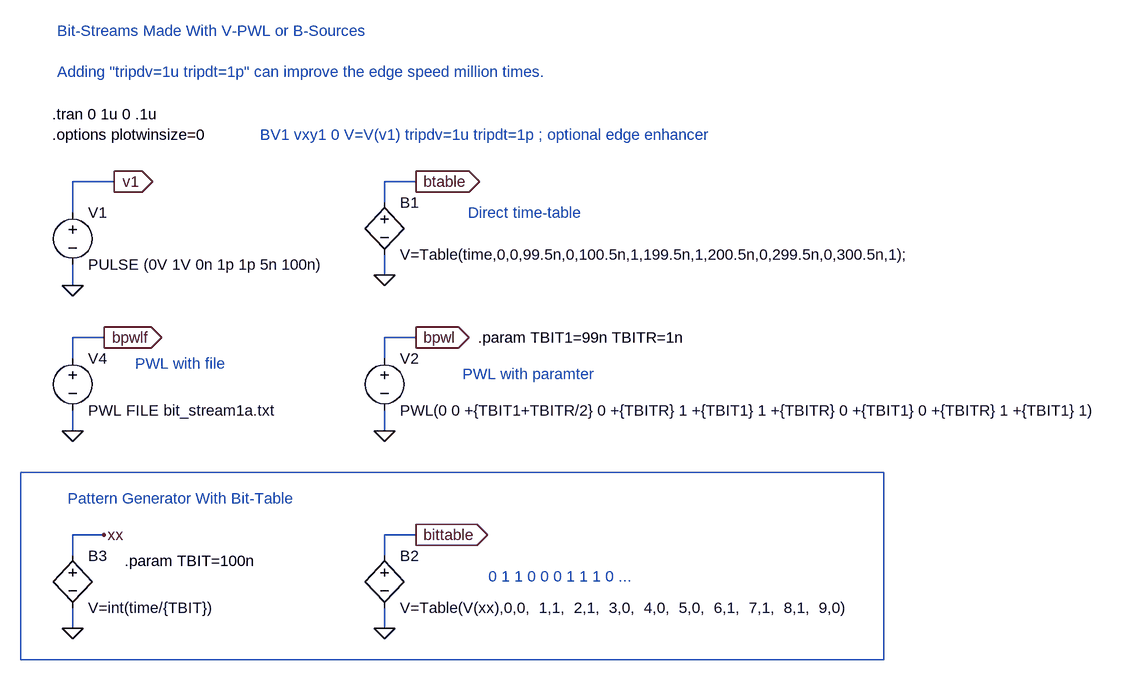
[diagram p0: schematic bit_stream.asc]
bit_stream.asc, the LTspice schematic file:
Version 4
SHEET 1 1644 708
WIRE -32 -32 -96 -32
WIRE 432 -32 384 -32
WIRE 384 0 384 -32
WIRE -96 16 -96 -32
WIRE 384 112 384 80
WIRE -96 128 -96 96
WIRE -48 208 -96 208
WIRE 432 208 384 208
WIRE -96 240 -96 208
WIRE 384 240 384 208
WIRE -96 352 -96 320
WIRE 384 352 384 320
WIRE -48 512 -96 512
WIRE 432 512 384 512
WIRE -96 544 -96 512
WIRE 384 544 384 512
WIRE -96 656 -96 624
WIRE 384 656 384 624
FLAG -96 128 0
FLAG -32 -32 v1
IOPIN -32 -32 Out
FLAG 384 352 0
FLAG -96 352 0
FLAG 384 112 0
FLAG 432 -32 btable
IOPIN 432 -32 Out
FLAG 432 208 bpwl
IOPIN 432 208 Out
FLAG -48 208 bpwlf
IOPIN -48 208 Out
FLAG 384 656 0
FLAG 432 512 bittable
IOPIN 432 512 Out
FLAG -96 656 0
FLAG -48 512 xx
SYMBOL voltage -96 0 R0
WINDOW 123 0 0 Left 0
WINDOW 39 0 0 Left 0
SYMATTR InstName V1
SYMATTR Value PULSE (0V 1V 0n 1p 1p 5n 100n)
SYMBOL voltage 384 224 R0
WINDOW 123 0 0 Left 0
WINDOW 39 0 0 Left 0
SYMATTR InstName V2
SYMATTR Value PWL(0 0 +{TBIT1+TBITR/2} 0 +{TBITR} 1 +{TBIT1} 1 +{TBITR} 0 +{TBIT1} 0 +{TBITR} 1 +{TBIT1} 1)
SYMBOL voltage -96 224 R0
WINDOW 123 0 0 Left 0
WINDOW 39 0 0 Left 0
SYMATTR InstName V4
SYMATTR Value PWL FILE bit_stream1a.txt
SYMBOL bv 384 -16 R0
SYMATTR InstName B1
SYMATTR Value V=Table(time,0,0,99.5n,0,100.5n,1,199.5n,1,200.5n,0,299.5n,0,300.5n,1);
SYMBOL bv 384 528 R0
SYMATTR InstName B2
SYMATTR Value V=Table(V(xx),0,0,  1,1,  2,1,  3,0,  4,0,  5,0,  6,1,  7,1,  8,1,  9,0)
SYMBOL bv -96 528 R0
SYMATTR InstName B3
SYMATTR Value V=int(time/{TBIT})
TEXT -128 -136 Left 0 !.tran 0 1u 0 .1u
TEXT -128 -104 Left 0 !.options plotwinsize=0
TEXT -120 -264 Left 0 ;Bit-Streams Made With V-PWL or B-Sources\n \nAdding "tripdv=1u tripdt=1p" can improve the edge speed million times.
TEXT 192 -104 Left 0 ;BV1 vxy1 0 V=V(v1) tripdv=1u tripdt=1p ; optional edge enhancer
TEXT 528 208 Left 0 !.param TBIT1=99n TBITR=1n
TEXT -16 552 Left 0 !.param TBIT=100n
TEXT 512 16 Left 0 ;Direct time-table
TEXT 504 264 Left 0 ;PWL with paramter
TEXT 0 248 Left 0 ;PWL with file
TEXT -104 456 Left 0 ;Pattern Generator With Bit-Table
TEXT 544 576 Left 0 ;0 1 1 0 0 0 1 1 1 0 ...
RECTANGLE Normal 1152 704 -176 416

The netlist it stands for:
* bit_stream.asc
V1 v1 0 PULSE (0V 1V 0n 1p 1p 5n 100n)
V2 bpwl 0 PWL(0 0 +{TBIT1+TBITR/2} 0 +{TBITR} 1 +{TBIT1} 1 +{TBITR} 0 +{TBIT1} 0 +{TBITR} 1 +{TBIT1} 1)
V4 bpwlf 0 PWL FILE bit_stream1a.txt
B1 btable 0 V=Table(time,0,0,99.5n,0,100.5n,1,199.5n,1,200.5n,0,299.5n,0,300.5n,1);
B2 bittable 0 V=Table(V(xx),0,0,  1,1,  2,1,  3,0,  4,0,  5,0,  6,1,  7,1,  8,1,  9,0)
B3 xx 0 V=int(time/{TBIT})
.tran 0 1u 0 .1u
.options plotwinsize=0
* Bit-Streams Made With V-PWL or B-Sources
* Adding "tripdv=1u tripdt=1p" can improve the edge speed million times.
* BV1 vxy1 0 V=V(v1) tripdv=1u tripdt=1p ; optional edge enhancer
.param TBIT1=99n TBITR=1n
.param TBIT=100n
* Direct time-table
* PWL with paramter
* PWL with file
* Pattern Generator With Bit-Table
* 0 1 1 0 0 0 1 1 1 0 ...
.backanno
.end